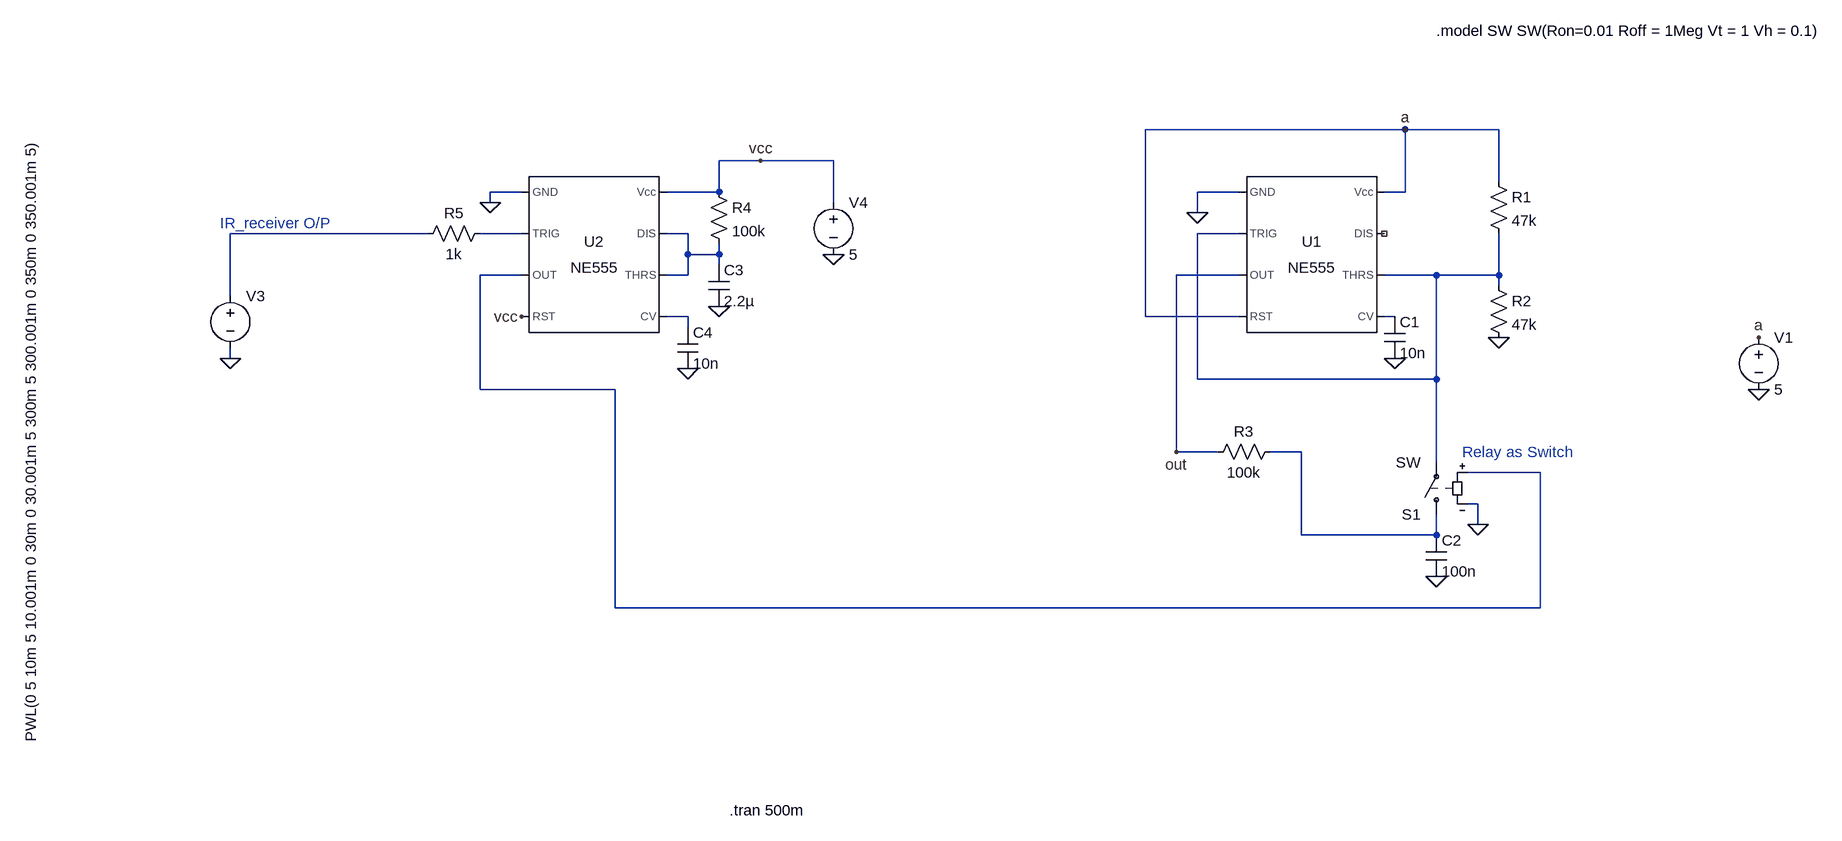
[diagram p0: schematic IR_Latch.asc]
IR_Latch.asc, the LTspice schematic file:
Version 4
SHEET 1 1024 888
WIRE 336 -176 -64 -176
WIRE 480 -176 336 -176
WIRE -656 -128 -720 -128
WIRE -544 -128 -656 -128
WIRE 480 -96 480 -176
WIRE -1024 -80 -1072 -80
WIRE -720 -80 -720 -128
WIRE -720 -80 -800 -80
WIRE 80 -80 16 -80
WIRE 336 -80 336 -176
WIRE 336 -80 304 -80
WIRE -1072 -64 -1072 -80
WIRE -544 -64 -544 -128
WIRE 16 -48 16 -80
WIRE -1168 -16 -1472 -16
WIRE -1024 -16 -1088 -16
WIRE -768 -16 -800 -16
WIRE 80 -16 16 -16
WIRE -768 16 -768 -16
WIRE -720 16 -720 0
WIRE -720 16 -768 16
WIRE -720 32 -720 16
WIRE -1024 48 -1088 48
WIRE -768 48 -768 16
WIRE -768 48 -800 48
WIRE 80 48 -16 48
WIRE 384 48 304 48
WIRE 480 48 480 -16
WIRE 480 48 384 48
WIRE 480 64 480 48
WIRE -1472 80 -1472 -16
WIRE -768 112 -800 112
WIRE -64 112 -64 -176
WIRE 80 112 -64 112
WIRE 320 112 304 112
WIRE -768 128 -768 112
WIRE -1472 176 -1472 160
WIRE 16 208 16 -16
WIRE 384 208 384 48
WIRE 384 208 16 208
WIRE -1088 224 -1088 48
WIRE -880 224 -1088 224
WIRE -16 320 -16 48
WIRE 48 320 -16 320
WIRE 176 320 128 320
WIRE 384 336 384 208
WIRE 544 352 432 352
WIRE 448 400 432 400
WIRE 448 432 448 400
WIRE 176 448 176 320
WIRE 384 448 384 416
WIRE 384 448 176 448
WIRE -880 560 -880 224
WIRE 544 560 544 352
WIRE 544 560 -880 560
FLAG 16 -48 0
FLAG 480 144 0
FLAG 320 176 0
FLAG 384 512 0
FLAG 880 224 0
FLAG 880 144 a
FLAG 336 -176 a
FLAG -16 320 out
FLAG -1072 -64 0
FLAG -720 96 0
FLAG -768 192 0
FLAG -544 16 0
FLAG -656 -128 vcc
FLAG -1024 112 vcc
FLAG -1472 176 0
FLAG 448 432 0
SYMBOL Misc\\NE555 192 16 R0
SYMATTR InstName U1
SYMBOL res 464 -112 R0
SYMATTR InstName R1
SYMATTR Value 47k
SYMBOL res 464 48 R0
SYMATTR InstName R2
SYMATTR Value 47k
SYMBOL cap 304 112 R0
SYMATTR InstName C1
SYMATTR Value 10n
SYMBOL cap 368 448 R0
SYMATTR InstName C2
SYMATTR Value 100n
SYMBOL res 144 304 R90
WINDOW 0 0 56 VBottom 2
WINDOW 3 32 56 VTop 2
SYMATTR InstName R3
SYMATTR Value 100k
SYMBOL voltage 880 128 R0
WINDOW 123 0 0 Left 0
WINDOW 39 0 0 Left 0
SYMATTR InstName V1
SYMATTR Value 5
SYMBOL Misc\\NE555 -912 16 R0
SYMATTR InstName U2
SYMBOL res -736 -96 R0
SYMATTR InstName R4
SYMATTR Value 100k
SYMBOL cap -736 32 R0
SYMATTR InstName C3
SYMATTR Value 2.2µ
SYMBOL res -1072 -32 R90
WINDOW 0 0 56 VBottom 2
WINDOW 3 32 56 VTop 2
SYMATTR InstName R5
SYMATTR Value 1k
SYMBOL cap -784 128 R0
SYMATTR InstName C4
SYMATTR Value 10n
SYMBOL voltage -1472 64 R0
WINDOW 3 -307 -236 VRight 2
WINDOW 123 0 0 Left 0
WINDOW 39 0 0 Left 0
SYMATTR Value PWL(0 5 10m 5 10.001m 0 30m 0 30.001m 5 300m 5 300.001m 0 350m 0 350.001m 5)
SYMATTR InstName V3
SYMBOL voltage -544 -80 R0
WINDOW 123 0 0 Left 0
WINDOW 39 0 0 Left 0
SYMATTR InstName V4
SYMATTR Value 5
SYMBOL sw 384 432 R180
SYMATTR InstName S1
TEXT 384 -328 Left 2 !.model SW SW(Ron=0.01 Roff = 1Meg Vt = 1 Vh = 0.1)
TEXT -704 872 Left 2 !.tran 500m
TEXT -1488 -32 Left 2 ;IR_receiver O/P
TEXT 424 320 Left 2 ;Relay as Switch

The netlist it stands for:
* IR_Latch.asc
XU1 0 N004 out a N007 N004 NC_01 a NE555  ; pins GND TRIG OUT RST CV THRS DIS Vcc
R1 a N004 47k
R2 N004 0 47k
C1 N007 0 10n
C2 N008 0 100n
R3 N008 out 100k
V1 a 0 5
XU2 0 N002 N005 vcc N006 N003 N003 vcc NE555  ; pins GND TRIG OUT RST CV THRS DIS Vcc
R4 vcc N003 100k
C3 N003 0 2.2µ
R5 N002 N001 1k
C4 N006 0 10n
V3 N001 0 PWL(0 5 10m 5 10.001m 0 30m 0 30.001m 5 300m 5 300.001m 0 350m 0 350.001m 5)
V4 vcc 0 5
S1 N008 N004 N005 0 SW
.model SW SW(Ron=0.01 Roff = 1Meg Vt = 1 Vh = 0.1)
.tran 500m
* IR_receiver O/P
* Relay as Switch
.lib NE555.sub
.backanno
.end